# Altium schematic sheet External_Trigger_Buffer.SchDoc
size A4; CompanyName: WEITI ISE; Address1: ul. Nowowiejska 15/19; Address2: 00-665 Warszawa; DocumentNumber: 6; SheetNumber: 6; SheetTotal: 7
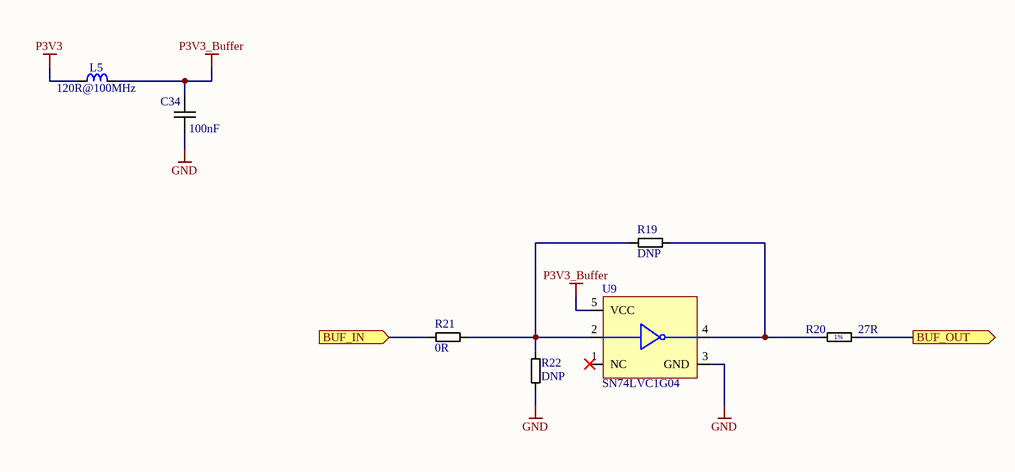
[diagram p0: External_Trigger_Buffer.SchDoc]

## Parts
C34  100nF  [CAPC0603X90N]
L5  120R@100MHz  [INDC0603X90N]
R19  DNP  [RESC0603X60N]
R20  27R  [RESC0603X60N]
R21  0R  [RESC0603X60N]
R22  DNP  [RESC0603X60N]
U9  SN74LVC1G04

## Ports
BUF_IN (in), BUF_OUT (out)

## Nets
GND: C34.2 R22.1 U9.3(GND)
P3V3: L5.1
P3V3_Buffer: C34.1 L5.2 U9.5(VCC)
BUF_IN: R21.1 ; port BUF_IN
BUF_OUT: R20.2 ; port BUF_OUT
NetR19_1: R19.1 R21.2 R22.2 U9.2(A)
NetR19_2: R19.2 R20.1 U9.4(Y)

Not connected (* = marked no-connect by the designer): U9 1(NC)*

## Notes on the sheet
- Project:
- Title
- File:
- Drawn by:
- Engineer:
- Checked by:
- Szymon Jedliński
- Sheet:
- Revision:
- Total Sheet:
- 1.0
- Variant:
- Approved by:
- Date:

## Library data of the parts
C34 = CC0603_100NF_16V_10%_X7R: Non-polarised capacitor; Manufacturer Part Number: VJ0603Y104KXJCW1BC; DesignItemId: CC0603_100NF_16V_10%_X7R; HelpURL: https://www.vishay.com/docs/28548/vjw1bcbascomseries.pdf; Height: 0.8mm; SMD: Yes; Value: 100nF
L5 = FB0603_120R@100MHZ_2A: Ferrite Bead; Manufacturer Part Number: BLM18PG121SN1D; Manufacturer 1 Component Height: 0.8mm; Tolerance: 25%; DesignItemId: FB0603_120R@100MHZ_2A; HelpURL: https://www.tme.eu/Document/19a35c43258593752611d1c31a7dbf1a/MURATA-BLM18P.pdf; SMD: Yes; Value: 120R@100MHz
R19 R22 = R0603_DNP: General Purpose Thick Film Chip Resistor; Manufacturer 1 Component Height: 0.5mm; Voltage: 75V; DesignItemId: R0603_DNP; HelpURL: https://www.vishay.com/docs/20035/dcrcwe3.pdf; SMD: Yes; Value: DNP
R20 = R0603_27R_0.1W_100PPM: General Purpose Thick Film Chip Resistor; Manufacturer Part Number: WF06P270JTL; Manufacturer 1 Component Height: 0.5mm; Tolerance: 1%; Voltage: 75V; DesignItemId: R0603_27R_0.1W_100PPM; HelpURL: https://www.vishay.com/docs/20035/dcrcwe3.pdf; SMD: Yes; Value: 27R
R21 = R0603_0R_JUMPER: General Purpose Thick Film Chip Resistor; Manufacturer Part Number: AC0603JR-070RL; Manufacturer 1 Component Height: 0.5mm; Tolerance: 20mOhm; Voltage: 75V; DesignItemId: R0603_0R_JUMPER; HelpURL: https://www.tme.eu/Document/92aeee148d633aa67924e3cf8825e6b4/AC0402FR-0710KL.PDF; SMD: Yes; Value: 0R
U9 = SN74LVC1G04: SINGLE INVERTER GATE; Manufacturer 1 Example: SN74LVC1G04MDBVREP; Manufacturer 1 Component Height: 1.45mm; DesignItemId: SN74LVC1G04; Device: SN74LVC1G04; Footprint: TSSOP-20; HelpURL: https://www.ti.com/lit/ds/symlink/txs0108e.pdf?ts=1625042999829&ref_url=https%253A%252F%252Fwww.google.com%252F; Manufacturer 1 Part Number: SN74LVC1G04MDBVREP; SMD: Yes